# EAGLE design Main Board Schematic V5 (EAGLE 8.2.2)
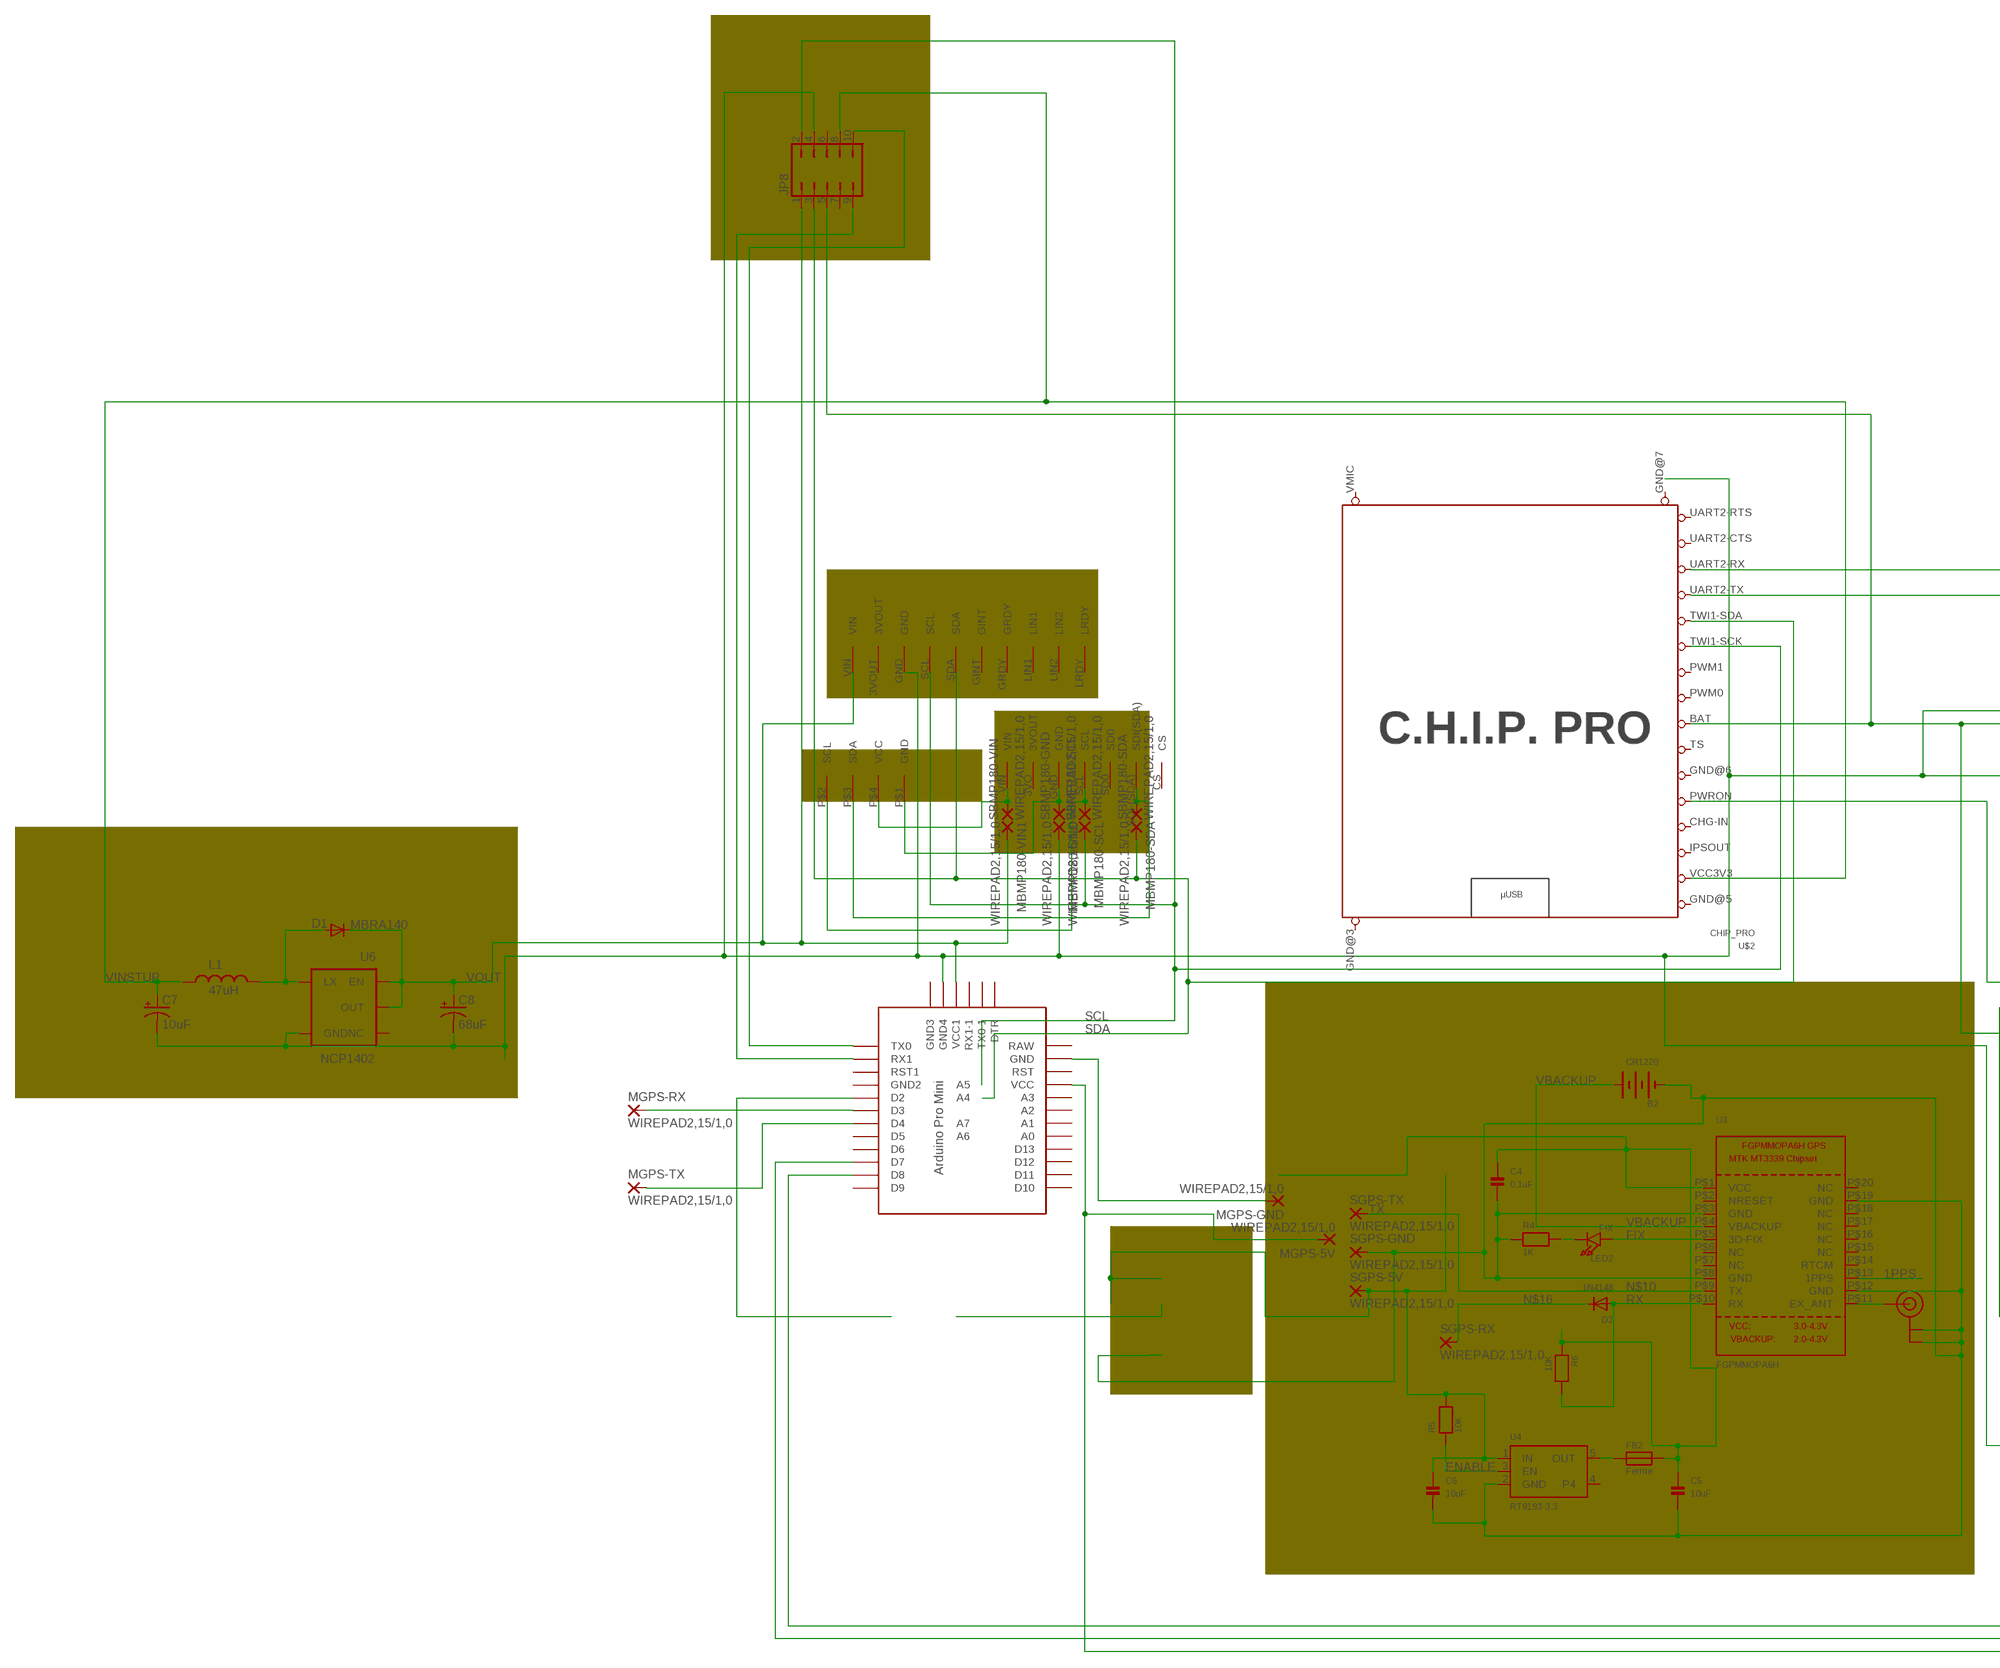
[diagram p0: schematic, sheet 1, part 1 of 2]
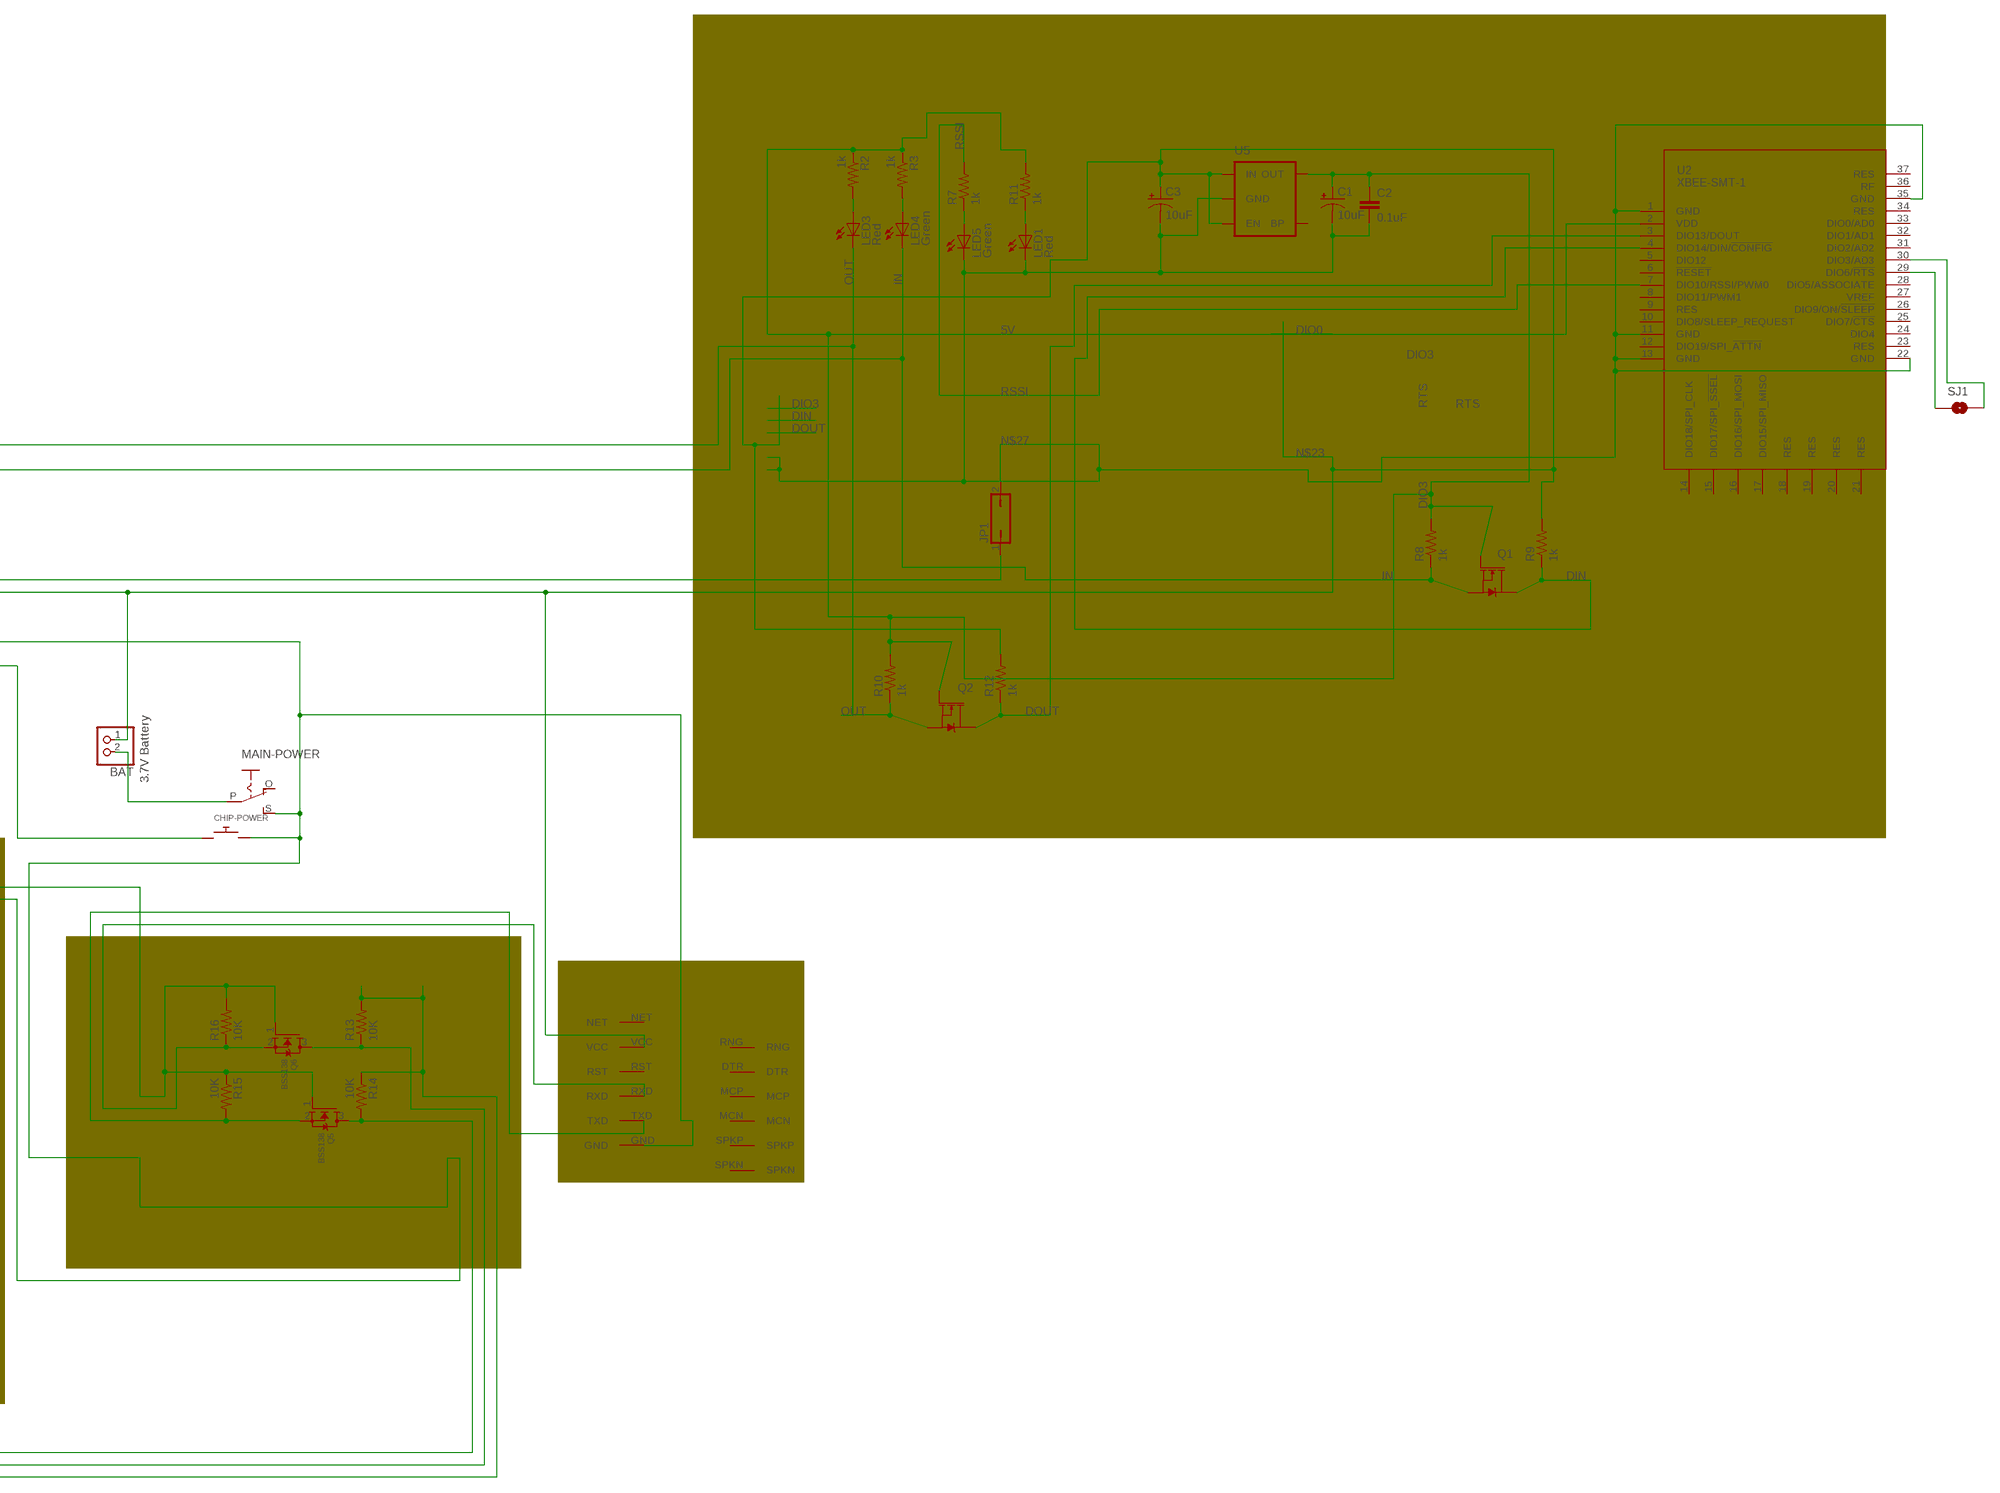
[diagram p1: schematic, sheet 1, part 2 of 2]

## Parts
B2  CR1220  BATTERYCR1220_SMT  [CR1220]
BAT  JST_2PIN-THM-RA  [JST-PH-2-THM-RA]
C1  10uF  CAP_POL1206  [EIA3216]
C2  0.1uF  CAP0402-CAP  [0402-CAP]
C3  10uF  10UF-POLAR-EIA3216-16V-10%(TANT)  [EIA3216]
C4  0.1uF  CAP_CERAMIC0805  [0805]
C5  10uF  CAP_CERAMIC0805  [0805]
C6  10uF  CAP_CERAMIC0805  [0805]
C7  10uF  CAP_POL1206  [EIA3216]
C8  68uF  68UF-POLAR-EIA3528-10V-10%(TANT)  [EIA3528]
CHIP-POWER  SWITCH_PUSHBUTTONEVQ-PE  [TACT_PANA-EVQ]
D1  MBRA140  DIODESMA  [SMA-DIODE]
D2  1N4148  DIODESOD-323F  [SOD-323F]
FB2  Ferrite  FERRITE0805  [0805]
JP1  JP1Q  [JP1]
JP8  JP5Q  [JP5Q]
L1  47uH  INDUCTORCR54  [CR54]
LED1  Red  LED0603  [LED-0603]
LED2  FIX  LED0805  [CHIPLED_0805]
LED3  Red  LED0603  [LED-0603]
LED4  Green  LED0603  [LED-0603]
LED5  Green  LED0603  [LED-0603]
MAIN-POWER  EG1218S  [EG1218]
MBMP180-GND  WIREPAD2,15/1,0  [2,15/1,0]
MBMP180-SCL  WIREPAD2,15/1,0  [2,15/1,0]
MBMP180-SDA  WIREPAD2,15/1,0  [2,15/1,0]
MBMP180-VIN1  WIREPAD2,15/1,0  [2,15/1,0]
MGPS-5V  WIREPAD2,15/1,0  [2,15/1,0]
MGPS-GND  WIREPAD2,15/1,0  [2,15/1,0]
MGPS-RX  WIREPAD2,15/1,0  [2,15/1,0]
MGPS-TX  WIREPAD2,15/1,0  [2,15/1,0]
Q1  5.8A/30V/35mΩ  MOSFET-NCH-AO3404A  [SOT23-3]
Q2  5.8A/30V/35mΩ  MOSFET-NCHANNEL-AO3404A  [SOT23-3]
Q5  BSS138  MOSFET-NREFLOW  [SOT23]
Q6  BSS138  MOSFET-NREFLOW  [SOT23]
R2  1k  RESISTOR0402-RES  [0402-RES]
R3  1k  RESISTOR0402-RES  [0402-RES]
R4  1K  RESISTOR0805  [0805]
R5  10K  RESISTOR0805  [0805]
R6  10K  RESISTOR0805  [0805]
R7  1k  RESISTOR0402-RES  [0402-RES]
R8  1k  RESISTOR0402-RES  [0402-RES]
R9  1k  RESISTOR0402-RES  [0402-RES]
R10  1k  RESISTOR0402-RES  [0402-RES]
R11  1k  RESISTOR0402-RES  [0402-RES]
R12  1k  RESISTOR0402-RES  [0402-RES]
R13  10K  R-US_R0805  [R0805]
R14  10K  R-US_R0805  [R0805]
R15  10K  R-US_R0805  [R0805]
R16  10K  R-US_R0805  [R0805]
SBMP180-GND  WIREPAD2,15/1,0  [2,15/1,0]
SBMP180-SCL  WIREPAD2,15/1,0  [2,15/1,0]
SBMP180-SDA  WIREPAD2,15/1,0  [2,15/1,0]
SBMP180-VIN  WIREPAD2,15/1,0  [2,15/1,0]
SGPS-5V  WIREPAD2,15/1,0  [2,15/1,0]
SGPS-GND  WIREPAD2,15/1,0  [2,15/1,0]
SGPS-RX  WIREPAD2,15/1,0  [2,15/1,0]
SGPS-TX  WIREPAD2,15/1,0  [2,15/1,0]
SJ1  SOLDERJUMPERNO  [SJ_2S-NO]
U2  XBEE-SMT-1  [XBEE-SMT]
U3  FGPMMOPA6H  GPS_FGPMMOPA6H  [FGPMMOPA6H]
U4  RT9193-3.3  VREG_SOT23-5  [SOT23-5]
U5  V_REG_LDOSMD  [SOT23-5@1]
U6  NCP1402  V_REG_NCP1400SOT23-5  [SOT23-5]
U$1  D6T  [D6T]
U$2  CHIP_PRO  [CHIP_PRO]
U$3  BMP180PINOUTBMP180  [BMP180]
U$4  9DOF  [9DOF]
U$5  PRO-MINI-2  [PRO-MINI-2]
U$8  SIM800L  [SIM800L]
U$32  U.FL  [U.FL]

## Nets
1PPS: U3.P$13(1PPS)
5V: C1.A(+) C2.1 Q1.1(G) Q2.1(G) R2.1 R3.1 R8.2 R10.2 R11.2 U2.2(VDD) U5.5(OUT)
A1: Q6.2(S) R16.1 U$8.RXD
A2: Q5.2(S) R15.2 U$8.TXD
B1: Q6.3(D) R13.1 U$5.D7
B2: Q5.3(D) R14.2 U$5.D8
DIN: Q1.3(D) R9.1 U2.4(DIO14/DIN/!CONFIG)
DIO3: SJ1.2 U2.30(DIO3/AD3)
DOUT: Q2.3(D) R12.1 U2.3(DIO13/DOUT)
ENABLE: R5.1 U4.3(EN)
FIX: LED2.A U3.P$5(3D-FIX)
GND: SBMP180-GND.1(P) U$1.P$1(GND) U$3.GND
IN: LED4.C Q1.2(S) R8.1 U$2.UART2-TX
N$1: LED2.C R4.2
N$2: BAT.2 MAIN-POWER.P
N$3: JP8.2 MBMP180-SCL.1(P) U$2.TWI1-SCK U$4.SCL U$5.A5
N$5: FB2.1 U4.5(OUT)
N$6: U3.P$11(EX_ANT) U$32.P$3(SIGNAL)
N$7: CHIP-POWER.P$1 U$2.PWRON
N$8: JP8.3 MBMP180-SDA.1(P) U$2.TWI1-SDA U$4.SDA U$5.A4
N$9: LED3.A R2.2
N$10: SGPS-TX.1(P) U3.P$9(TX)
N$11: LED4.A R3.2
N$12: JP8.10 U$5.TX0
N$13: LED5.A R7.1
N$14: D1.A L1.P$2 U6.5(LX)
N$15: JP8.9 U$5.RX1
N$16: D2.C SGPS-RX.1(P)
N$17: MGPS-GND.1(P) U$5.GND
N$18: U$5.D2
N$19: SBMP180-VIN.1(P) U$1.P$4(VCC) U$3.VIN
N$21: SBMP180-SCL.1(P) U$1.P$2(SCL) U$3.SCL
N$22: SBMP180-SDA.1(P) U$1.P$3(SDA) U$3.SDI-(SDA)(SDI(SDA))
N$23: BAT.1 C3.+ JP8.5 Q5.1(G) Q6.1(G) R9.2 R12.2 R15.1 R16.2 U5.1(IN) U5.3(EN) U$2.BAT U$8.VCC
N$24: C4.1 C5.1 FB2.2 R6.1 U3.P$1(VCC)
N$27: C1.C(-) C2.2 C3.- JP1.2 LED1.C LED5.C U2.1(GND) U2.11(GND) U2.13(GND) U2.22(GND) U2.35(GND) U5.2(GND)
N$29: MGPS-5V.1(P) R13.2 R14.1 U$5.VCC
N$33: C6.1 R5.2 SGPS-5V.1(P) U4.1(IN)
N$34: B2.- C4.2 C5.2 C6.2 R4.1 SGPS-GND.1(P) U3.P$3(GND) U3.P$8(GND) U3.P$12(GND) U3.P$19(GND) U4.2(GND) U$32.P$1(GND) U$32.P$2(GND)
N$35: C7.C(-) C8.C(-) CHIP-POWER.P$2 JP1.1 JP8.4 MAIN-POWER.S MBMP180-GND.1(P) U6.4(GND) U$4.GND U$5.GND3(GND4) U$8.GND
N$38: LED1.A R11.1
OUT: LED3.C Q2.2(S) R10.1 U$2.UART2-RX
RSSI: R7.2 U2.7(DIO10/RSSI/PWM0)
RTS: SJ1.1 U2.29(DIO6/!RTS)
RX: D2.A R6.2 U3.P$10(RX)
RX_5V: MGPS-RX.1(P) U$5.D3
TX: MGPS-TX.1(P) U$5.D4
VBACKUP: B2.+$1(+) U3.P$4(VBACKUP)
VINSTUP: C7.A(+) JP8.8 L1.P$1 U$2.VCC3V3
VOUT: C8.A(+) D1.C JP8.1 MBMP180-VIN1.1(P) U6.1(EN) U6.2(OUT) U$4.VIN U$5.VCC1
Unconnected: JP8.6 JP8.7 MAIN-POWER.O U2.5(DIO12) U2.6(!RESET) U2.8(DIO11/PWM1) U2.9(RES) U2.10(DIO8/SLEEP_REQUEST) U2.12(DIO19/SPI_!ATTN) U2.14(DIO18/SPI_CLK) U2.15(DIO17/SPI_!SSEL) U2.16(DIO16/SPI_MOSI) U2.17(DIO15/SPI_MISO) U2.18(RES) U2.19(RES) U2.20(RES) U2.21(RES) U2.23(RES) U2.24(DIO4) U2.25(DIO7/!CTS) U2.26(DIO9/ON/!SLEEP) U2.27(VREF) U2.28(DIO5/ASSOCIATE) U2.31(DIO2/AD2) U2.32(DIO1/AD1) U2.33(DIO0/AD0) U2.34(RES) U2.36(RF) U2.37(RES) U3.P$2(NRESET) U3.P$6(NC) U3.P$7(NC) U3.P$14(RTCM) U3.P$15(NC) U3.P$16(NC) U3.P$17(NC) U3.P$18(NC) U3.P$20(NC) U4.4 U5.4(BP) U6.3(NC) U$2.PWM0 U$2.PWM1 U$2.TS U$2.UART2-CTS U$2.UART2-RTS U$2.VMIC U$3.3VO(3VOUT) U$3.CS U$3.SD0 U$4.3VOUT U$4.GINT U$4.GRDY U$4.LIN1 U$4.LIN2 U$4.LRDY U$5.A0 U$5.A1 U$5.A2 U$5.A3 U$5.A6 U$5.A7 U$5.D5 U$5.D6 U$5.D9 U$5.D10 U$5.D11 U$5.D12 U$5.D13 U$5.DTR U$5.GND1(GND2) U$5.GND2(GND3) U$5.RAW U$5.RST U$5.RST1 U$5.RX1-1 U$5.TX0-1 U$8.DTR U$8.MCN U$8.MCP U$8.NET U$8.RNG U$8.RST U$8.SPKN U$8.SPKP

## Notes on the sheet
- HEADERS
- MIC5219-3.3V
- 500mA peak
- 9DOF IMU
- D6T Pins
  GND VCC SDA SCL
- BMP180
- 5V step up | 3.7V Battery
- XBee 3.3V Step Down
- SCL
- SDA | GPS
- SIM800L
- DHT22
- Logic Level Shifter 2Chnl
- gnd to gnd
- D1+R3 restrict RX input to 3.3V

## Power pins joined to a net without a drawn wire
CHG-IN: U$2.CHG-IN
GND: U$2.GND@3(GND) U$2.GND@5(GND) U$2.GND@6(GND) U$2.GND@7(GND)
IPSOUT: U$2.IPSOUT

## Library data of the parts
B2 = microbuilder:BATTERY
BAT = adafruit:JST_2PIN: JST 2-Pin Connectors of various flavors SMT-RA (S2B-PH-SM4) 4UConnector #17311 SMT (B2B-PH-SM4) THM-RA (S2B-PH) THM (B2B-PH)
C1 C7 = SparkFun:CAP_POL: Capacitor Polarized These are standard SMD and PTH capacitors. Normally 10uF, 47uF, and 100uF in electrolytic and tantalum varieties. Always verify the external diameter of the through hole cap, it varies with capacity, voltage, and manufacturer. The EIA devices should be standard.
C2 = SparkFun:CAP: Capacitor Standard 0603 ceramic capacitor, and 0.1" leaded capacitor.
C3 = SparkFun-Capacitors:10UF-POLAR: 10.0µF polarized capacitors A capacitor is a passive two-terminal electrical component used to store electrical energy temporarily in an electric field.; PROD_ID: CAP-00811
C4-C6 = microbuilder:CAP_CERAMIC: Ceramic Capacitors 0402 - 0402 Surface Mount Capacitors 16pF 50V 5% [Digikey: 445-4899-2-ND] 18pF 50V 5% [Digikey: 490-1281-2-ND] 22pF 50V 5% [Digikey: 490-1283-2-ND] 68pF 50V 5% [Digikey: 490-1289-2-ND] 0.1uF 10V 10% [Digikey: 490-1318-2-ND] 1.0uF 6.3V 10% [Digikey: 490-1320-2-ND] 0603 - 0603 Surface Mount Capacitors 16 pF 50V 5% [Digikey: 445-5051-2-ND] 22 pF 50V [Digikey: PCC220ACVTR-ND] 33 pF 50V 5% [Digikey: 490-1415-1-ND] 56pF 50V 5% [Digikey: 490-1421-1-ND] 220pF 50V 5% [Digikey: 445-1285-1-ND] 680 pF 50V 2200 pF 50V 5% C0G [Digikey: 445-1297-1-ND] 5600 pF 100V 5% X7R [Digikey: 478-3711-1-ND] 0.1 µF 25V 10% [Digikey: PCC2277TR-ND] 0.22 µF 16V 10% X7R [Digikey: 445-1318-1-ND] 1.0 µF 25V 10% [Digikey: 445-5146-2-ND] 0603 - RF Specific 3pF 250V +/-0.1pF RF [Digikey: 712-1347-1-ND] 18 pF 250V 5% [Digikey: 478-3505-1-ND or 712-1322-1-ND] 56 pF 250V 5% C0G RF [Digikey: 490-4867-1-ND] 68 pF 250V RF [Digikey: 490-4868-1-ND] 0805 - 0805 Surface Mount Capacitors 220 pF 250V 2% RF Ceramic Capacitor [Digikey: 712-1398-1-ND] 1000 pF 50V 2% NP0 Ceramic Capacitor [Digikey: 478-3760-1-ND] 0.1 µF 25V 10% Ceramic Capacitor [Digikey: PCC1828TR-ND] 1.0 µF 16V 10% Ceramic Capacitor[Digikey: 490-1691-2-ND] 10.0 µF 10V 10% Ceramic Capacitor[Digikey: 709-1228-1-ND] 10.0 uF 16V 10% Ceramic Capacitor [Digikey: 478-5165-2-ND] 47 uF 6.3V 20% Ceramic Capacitor [Digikey: 587-1779-1-ND or 399-5506-1-ND] 1206 - 1206 Surface Mount Capacitors 47uF 10V 20% Ceramic Capacitor [Digikey: 490-5528-1-ND or 399-5508-1-ND or 445-6010-1-ND] 100uF 6.3V -20%, +80% Y5V Ceramic Capacitor (Digikey: 490-4512-1-ND, Mouser: 81-GRM31CF50J107ZE1L)
C8 = SparkFun-Capacitors:68UF-POLAR: 68µF polarized capacitors A capacitor is a passive two-terminal electrical component used to store electrical energy temporarily in an electric field.; PROD_ID: CAP-10790
CHIP-POWER = adafruit:SWITCH_PUSHBUTTON: Buttons SOFTTOUCHSMD_SJ - Soft touch temporary push button (Super Junk Akihabara) Compatible with SKPMANE010 [Mouser: 688-SKPMAN] C&K_KSS = Digikey: KSS221GLFS
D1 = SparkFun:DIODE: Diode
D2 = adafruit:DIODE: Diode
FB2 = microbuilder:FERRITE: Ferrite Bead 0603 MMZ1608B121C - 120 Ohm, 600mA Ferrite Chip - Digikey: 445-2164-1-ND BK1608HW121-T - 120 Ohm, 600mA Ferrite Chip - Digikey: 587-1876-2-ND
JP1 = jumper:JP1Q: JUMPER
JP8 = jumper:JP5Q: JUMPER
L1 = SparkFun:INDUCTOR: Inductors Basic Inductor/Choke - 0603 and 1206. Footprints are not proven and vary greatly between part numbers.
LED1 LED3-LED5 = SparkFun:LED: LEDs Standard schematic elements and footprints for 5mm, 3mm, 1206, and 0603 sized LEDs. 5mm - Spark Fun Electronics SKU : COM-00529 (and others)
LED2 = microbuilder:LED: LED 0603 - 0603 Surface Mount Package 2mA: Green LED - Low Power (3.9mcd, 2ma, 1.7Vf) - Digikey: 475-2709-2-ND Orange LED - Low Power (9.8mcd, 2ma, 1.8Vf) - Digikey: 475-1194-2-ND Red LED - Low Power (5mcd, 2ma, 1.8Vf) - Digikey: 475-1195-2-ND Yellow LED - Low Power (7mcd, 2ma, 1.8Vf) - Digikey: 475-1196-2-ND 5mA: Blue LED - Low Power (17mcd, 5ma, 2.9Vf) - Digikey: LNJ937W8CRACT-ND 0805 - 0805 Surface Mount Package 2mA: Red LED (8.8mcd, 2mA, 1.8Vf, Clear) - Low Power [Digikey: 475-2510-1-ND] Green LED (5mcd, 2mA, 1.8Vf, Clear) - Low Power [Digikey: 475-2730-1-ND] Yellow LED (11.3mcd, 2mA, 1.8Vf, Clear) - Low Power [Digikey: 475-2555-1-ND] 20mA: Red LED (104mcd, 20mA, Diffused) - LS R976 [Digikey: 475-1278-6-ND] Red LED (12mcd, 20mA, 2.0Vf, Clear) - APT2012EC [Digikey: 754-1128-1-ND] Green LED (15mcd, 20mA, 2.2Vf, Clear) - APT2012GC [Digikey: 754-1131-1-ND] Orange LED (160mcd, 20mA, 2.1Vf, Clear) - APT2012SECK [Digikey: 754-1130-1-ND] 1206 - 1206 Surface Mount Package Green LED (26mcd, 20mA, Diffused) - LG N971 [Digikey: 475-1407-6-ND] Red LED (15mcd, 20mA, Diffused) - LH N974 [Digikey: 475-1416-6-ND]
MAIN-POWER = adafruit:EG1218: SLIDING SWITCH 0.1" spacing through hole, vertical SPDT slide switch http://www.ladyada.net/library/pcb/eaglelibrary.html
MBMP180-GND MBMP180-SCL MBMP180-SDA MBMP180-VIN1 MGPS-5V MGPS-GND MGPS-RX MGPS-TX SBMP180-GND SBMP180-SCL SBMP180-SDA SBMP180-VIN SGPS-5V SGPS-GND SGPS-RX SGPS-TX = wirepad:WIREPAD: Wire PAD connect wire on PCB
Q1 = SparkFun-DiscreteSemi:MOSFET-NCH: N-channel MOSFETs Voltage controlled devices that allow control of high current outputs. SparkFun Products: SparkFun OpenScale <https://www.sparkfun.com/products/13261> SparkFun Digital Sandbox <https://www.sparkfun.com/products/12651> SparkFun Monster Moto Shield <https://www.sparkfun.com/products/10182> SparkFun MOSFET Power Controller <https://www.sparkfun.com/products/11214>; PROD_ID: TRANS-12988
Q2 = SparkFun-DiscreteSemi:MOSFET-NCHANNEL: N-channel MOSFETs Voltage controlled devices that allow control of high current outputs. SparkFun Products: SparkFun OpenScale <https://www.sparkfun.com/products/13261> SparkFun Digital Sandbox <https://www.sparkfun.com/products/12651> SparkFun Monster Moto Shield <https://www.sparkfun.com/products/10182> SparkFun MOSFET Power Controller <https://www.sparkfun.com/products/11214>; PROD_ID: TRANS-12988
Q5 Q6 = adafruit:MOSFET-N: N-Channel Mosfet 2N7002E - 60V 260mA SOT23 [Digikey: 2N7002ET1GOSTR-ND] - REEL BSH103 - 30V 850mA SOT23 [Digikey: 568-5013-1-ND]
R2 R3 R7-R12 = SparkFun:RESISTOR: Resistor Basic schematic elements and footprints for 0603, 1206, and PTH 1/10th watt (small) resistors.
R4-R6 = microbuilder:RESISTOR: Resistors 0402 - 0402 Surface Mount Package 22 Ohm 1% 1/16W [Digikey: 311-22.0LRTR-ND] 33 Ohm 5% 1/16W 1.0K 5% 1/16W 1.5K 5% 1/16W 2.0K 1% 1/16W 10.0K 1% 1/16W [Digikey: 311-10.0KLRTR-ND] 10.0K 5% 1/16W [Digikey: RMCF0402JT10K0TR-ND] 12.1K 1% 1/16W [Digikey: 311-22.0LRTR-ND] 100.0K 5% 1/16W 0603 - 0603 Surface Mount Package 0 Ohm 1/10 Watt 1% Resistor 15 Ohm 1/10 Watt 1% Resistor 33 Ohm 1/10 Watt 1% Resistor 49.9 Ohm 1/10 Watt 1% Resistor 100 Ohm 1/10 Watt 1% Resistor 150 Ohm 1/10 Watt 1% Resistor 240 Ohm 1/10 Watt 1% Resistor 390 Ohm 1/10 Watt 1% Resistor 560 Ohm 1/10 Watt 1% Resistor 680 Ohm 1/10 Watt 1% Resistor 750 Ohm 1/10 Watt 1% Resistor 1.0K Ohm 1/10 Watt 1% Resistor 1.5K Ohm 1/10 Watt 1% Resistor 2.0K Ohm 1/10 Watt 1% Resistor 2.2K Ohm 1/10 Watt 1% Resistor 3.3K Ohm 1/10 Watt 1% Resistor 4.7K Ohm 1/10 Watt 1% Resistor 10.0K Ohm 1/10 Watt 1% Resistor 12.0K Ohm 1/10 Watt 1% Resistor 12.1K Ohm 1/10 Watt 1% Resistor 20.0K Ohm 1/10 Watt 1% Resistor 33.0K Ohm 1/10 Watt 1% Resistor 100.0K Ohm 1/10 Watt 1% Resistor 0805 - 0805 Surface Mount Package 0 Ohm 1/8 Watt 1% Resistor 33 Ohm 1/8 Watt 1% Resistor 100 Ohm 1/8 Watt 1% Resistor 150 Ohm 1/8 Watt 1% Resistor 200 Ohm 1/8 Watt 1% Resistor 240 Ohm 1/8 Watt 1% Resistor 330 Ohm 1/8 Watt 1% Resistor 390 Ohm 1/8 Watt 1% Resistor 470 Ohm 1/8 Watt 1% Resistor 1.0K Ohm 1/8 Watt 1% Resistor 1.5K Ohm 1/8 Watt 1% Resistor 2.0K Ohm 1/8 Watt 1% Resistor 4.7K Ohm 1/8 Watt 1% Resistor 5.1K Ohm 1/8 Watt 1% Resistor 5.6K Ohm 1/8 Watt 1% Resistor 10.0K Ohm 1/8 Watt 1% Resistor 22.0K Ohm 1/8 Watt 1% Resistor 33.0K Ohm 1/8 Watt 1% Resistor 100K Ohm 1/8 Watt 1% Resistor 1206 - 1206 Surface Mount Package 2012 - 2010 Surface Mount Package 0.11 Ohm 1/2 Watt 1% Resistor - Digikey: RHM.11UCT-ND
R13-R16 = adafruit:R-US_: RESISTOR, American symbol
SJ1 = SparkFun:SOLDERJUMPER: Solder Jumper Standard SMD solder jumper. Used to automate production. Two varients : Normally Open and Normally Closed are the same, but have different paste layers. NC will have a large amount of paste and should jumper during reflow.
U2 = rlc:XBEE-SMT-1
U3 = microbuilder:GPS_FGPMMOPA6H: GPS Module - MTK MT3339 Chipset, -165dBm sensitivity, 22 channels, 10Hz, auto-select external antenna options
U4 = microbuilder:VREG_SOT23-5: SOT23-5 Fixed Voltage Regulators To better organise some of the SOT23-5 fixed voltage regulators in this library, this new part was created. Part Current Out V Out V In V Dropout Digikey Part No. ADP121 150mA 3.3V 3.4-5.5V 0.09V @ 150mA ADP121-AUJZ33R7CT-ND ADP121 150mA 3.0V 3.1-5.5V 0.09V @ 150mA ADP121-AUJZ30R7CT-ND ADP122 300mA 3.3V 3.4-5.5V 0.085V @ 300mA ADP122AUJZ-3.3-R7CT-ND ADP1712 300mA 3.3V 3.5-5.5V 0.17V @ 300mA ADP1712AUJZ-3.3-R7TR-ND AP7311 (Low Cost) 150mA 3.3V 3.5-6V 0.15V @ 150mA AP7311-33WG-7DICT-ND LD39015M18R 150mA 1.8V 1.9V-5.5V 0.08V @ 100mA 497-6977-1-ND MCP1824T-3302E/OT 300mA 3.3V 3.5V-6V 0.2V @ 300mA MCP1824T-3302E/OTCT-ND MIC5205-2.5YM5 TR 150mA 2.5V 2.7-16V 0.165V @ 150mA 576-1257-2-ND MIC5205-3.0YM5 TR 150mA 3.0V 3.2V-16V 0.165V @ 150mA 576-1258-2-ND MIC5205-3.3YM5 TR 150mA 3.3V 3.5V-16V 0.165V @ 150mA 576-1259-2-ND TPS780330220 150mA 3.3V+2.2V 3.6-5.5V 250mV Max 296-23332-1-ND TDA3663/N1,135 100mA 3.3V 3.5-45V 0.18V @ 50mA 568-5343-1-ND
U5 = SparkFun:V_REG_LDO: Voltage Regulator LDO Standard 150mA LDO voltage regulator in SOT-23 layout. Micrel part MIC5205. BP (by-pass) pin is used to lower output noise with 470pF cap.
U6 = SparkFun:V_REG_NCP1400: Switching step-up voltage regulator NCP1400 switiching regulator takes single cell AA and outputs 100mA at 3.3V or 5V with minimal number of external components.
U$1 = D6T Pins:D6T
U$2 = CHIP_Pro-Footprint:CHIP_PRO
U$3 = BME180:BMP180PINOUT
U$4 = 9DOF IMU:9DOF
U$5 = Arduino-clone:PRO-MINI-2: Arduino Pro Mini Layout 2 Sparkfun.com
U$8 = SIM800L:SIM800L
U$32 = microbuilder:U.FL: U.FL Antenna Connector

## Net classes
1 vcc: width 0.305 mm

## Board
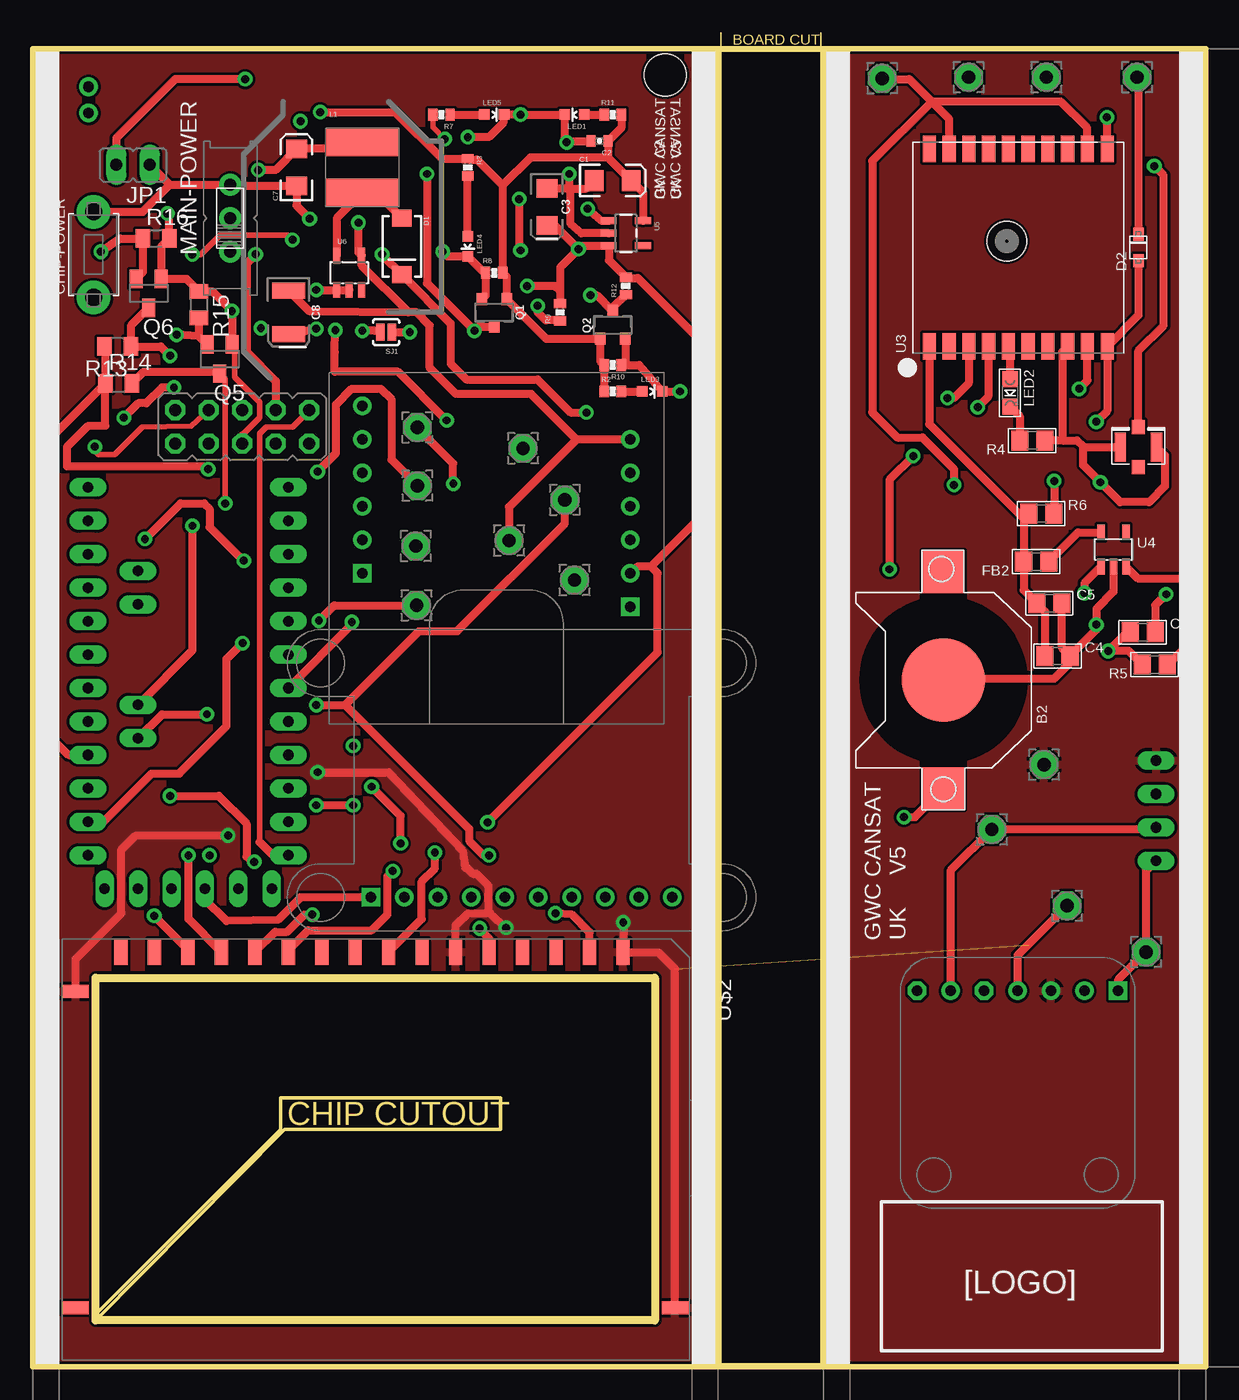
[diagram p2: board, top side]
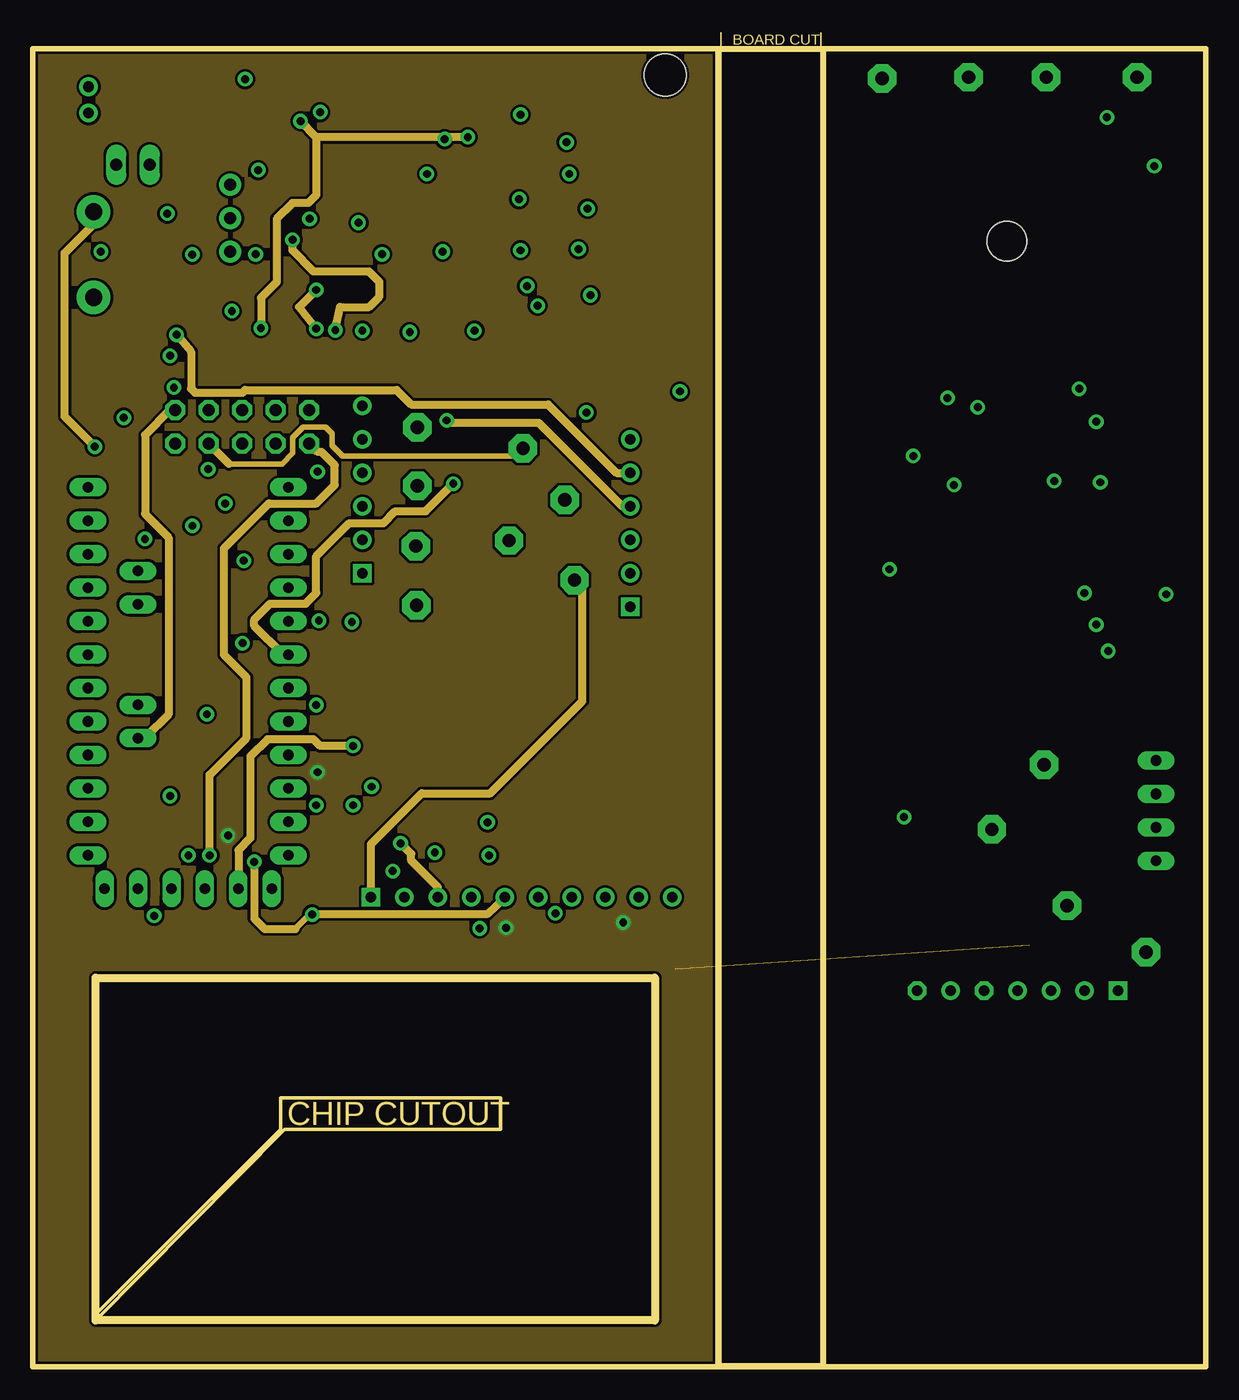
[diagram p3: board, inner layer Route2]
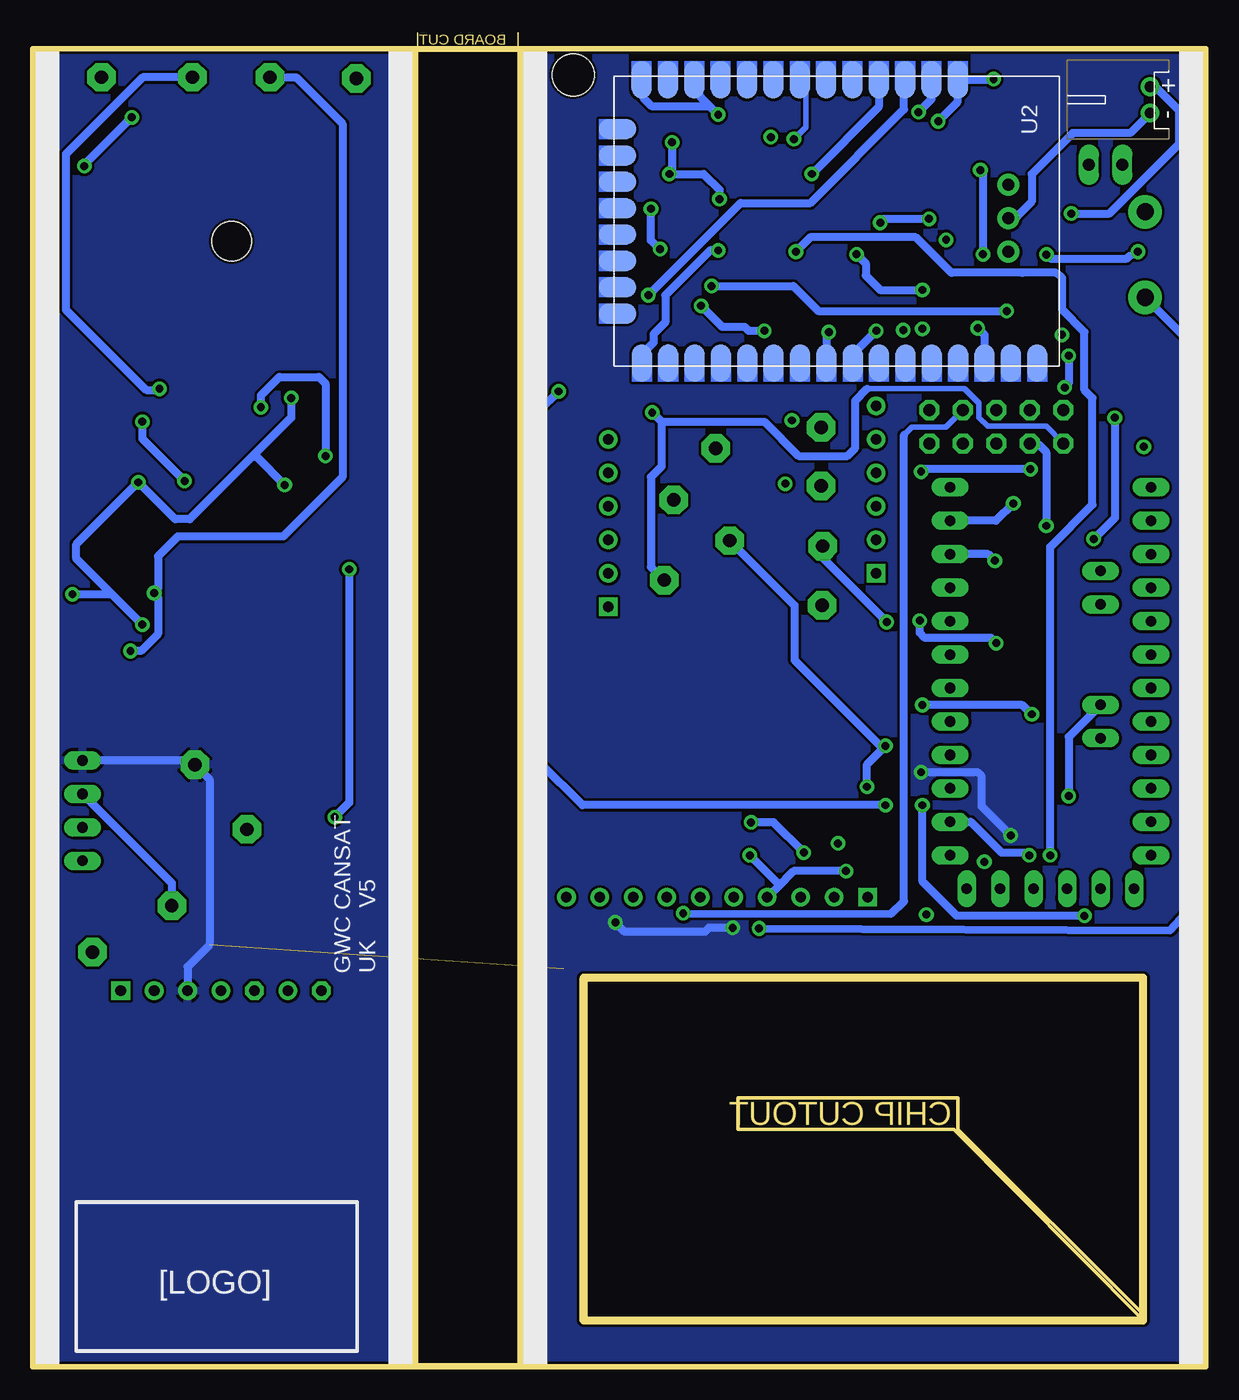
[diagram p4: board, bottom side, seen from below]

Size 89 x 101.2 mm. Coordinates in mm from the lower left corner, seen from the top.
Outline: 52,0 0,0 0,100 52,100
Outline: 52,0 52,100
Outline: 60,0 60,100
Outline: 60,100 89,100 89,0 60,0
Outline: 52,0 60,0
Outline: 52,100 60,100
Outline: 52.2,99.8 52.2,101.2
Outline: 59.8,100.2 59.8,101.2
Outline: 4.75,29.5 47.2,29.5 47.2,3.5 4.75,3.5 4.75,29.5
Copper layers (1*16): Top 0.035mm / dielectric 1.5mm / Bottom 0.035mm
Design rules "SparkFun": minimum track width 8mil, minimum drill 20mil, track to track 8mil, track to pad 8mil, pad to pad 8mil, via to via 8mil, smd to smd 8mil, copper to edge 8mil, drill to drill 8mil, minimum pad ring 12mil, minimum via ring 10mil, stop-mask expansion 4mil, vias tented up to drill 20mil, thermal gap 10mil
Holes 3.2 mm at 48,98

### Footprints (pad centres in the part's own frame; a part is rotated, then mirrored left to right if it is on the bottom)
CR1220 = smd 3.2 x 3.2: +$1 -8.225,0; +$2 8.225,0 | smd 6.35 x 6.35: - 0,0
JST-PH-2-THM-RA = drill 0.8 pad 1.422: 1 1,0; 2 -1,0
EIA3216 = smd 1.4 x 1.6: A 1.4,0; C -1.4,0
0402-CAP = smd 0.7 x 0.9: 1 -0.65,0; 2 0.65,0
EIA3216' = smd 1.4 x 1.6: + 1.4,0; - -1.4,0
0805 = smd 1.3 x 1.5: 1 -0.95,0; 2 0.95,0
EIA3528 = smd 1.2 x 2.5: A 1.65,0; C -1.65,0
TACT_PANA-EVQ = drill 1.3 pad 2.54: P$1 -3.25,0; P$2 3.25,0
SMA-DIODE = smd 1.27 x 1.47: A -2.15,0; C 2.15,0
SOD-323F = smd 1 x 0.8: A -1,0; C 1,0
JP1 = drill 0.914 long: 1 0,-1.27; 2 0,1.27
JP5Q = drill 0.914 octagon: 1 -5.08,-1.27; 2 -5.08,1.27; 3 -2.54,-1.27; 4 -2.54,1.27; 5 0,-1.27; 6 0,1.27; 7 2.54,-1.27; 8 2.54,1.27; 9 5.08,-1.27; 10 5.08,1.27
CR54 = smd 5.5 x 2.15: P$1 0,1.92; P$2 0,-1.92
LED-0603 = smd 0.8 x 0.8: A 0,-0.75; C 0,0.75
CHIPLED_0805 = smd 1.2 x 1.2: A 0,-1.05; C 0,1.05
EG1218 = drill 0.9 pad 1.676: O -2.54,0; P 0,0; S 2.54,0
2,15/1,0 = drill 1.016 pad 2.159 octagon: 1 0,0
SOT23-3 = smd 0.8 x 0.9: 1 -0.95,-1; 2 0.95,-1; 3 0,1.1
SOT23 = smd 1 x 1.4: 1 -0.95,-1.1; 2 0.95,-1.1; 3 0,1.1
0402-RES = smd 0.7 x 0.9: 1 -0.65,0; 2 0.65,0
R0805 = smd 1.1 x 1.4: 1 -1,0; 2 1,0
SJ_2S-NO = smd 0.635 x 1.27: 1 -0.45,0; 2 0.45,0
XBEE-SMT = smd 2.84 x 1.52: 1 -10.745,9.19; 2 -10.745,7.19; 3 -10.745,5.19; 4 -10.745,3.19; 5 -10.745,1.19; 6 -10.745,-0.81; 7 -10.745,-2.81; 8 -10.745,-4.81; 9 -10.745,-6.81; 10 -10.745,-8.81; 11 -10.745,-10.81; 12 -10.745,-12.81; 13 -10.745,-14.81; 22 10.745,-14.79; 23 10.745,-12.79; 24 10.745,-10.79; 25 10.745,-8.79; 26 10.745,-6.79; 27 10.745,-4.79; 28 10.745,-2.79; 29 10.745,-0.79; 30 10.745,1.21; 31 10.745,3.21; 32 10.745,5.21; 33 10.745,7.21; 34 10.745,9.21; 35 10.745,11.21; 36 10.745,13.21; 37 10.745,15.21 | smd 1.52 x 2.84: 14 -7,-16.64; 15 -5,-16.64; 16 -3,-16.64; 17 -1,-16.64; 18 1,-16.64; 19 3,-16.64; 20 5,-16.64; 21 7,-16.64
FGPMMOPA6H = smd 2 x 1: P$1 -7.5,6.75; P$2 -7.5,5.25; P$3 -7.5,3.75; P$4 -7.5,2.25; P$5 -7.5,0.75; P$6 -7.5,-0.75; P$7 -7.5,-2.25; P$8 -7.5,-3.75; P$9 -7.5,-5.25; P$10 -7.5,-6.75; P$11 7.5,-6.75; P$12 7.5,-5.25; P$13 7.5,-3.75; P$14 7.5,-2.25; P$15 7.5,-0.75; P$16 7.5,0.75; P$17 7.5,2.25; P$18 7.5,3.75; P$19 7.5,5.25; P$20 7.5,6.75 | hole 3: 0.5,0.85
SOT23-5 = smd 0.55 x 1.2: 1 -0.95,-1.3; 2 0,-1.3; 3 0.95,-1.3; 4 0.95,1.3; 5 -0.95,1.3
SOT23-5@1 = smd 0.55 x 1.2: 1 -0.95,-1.3; 2 0,-1.3; 3 0.95,-1.3; 4 0.95,1.3; 5 -0.95,1.3
D6T = drill 0.8 long: P$1 0,0; P$2 0,2.54; P$3 0,5.08; P$4 0,7.62
CHIP_PRO = smd 2 x 1: BAT -15,1.27; CHG-IN -15,11.43; GND@5 -15,19.05; GND@6 -15,6.35; IPSOUT -15,13.97; PWM0 -15,-1.27; PWM1 -15,-3.81; PWRON -15,8.89; TS -15,3.81; TWI1-SCK -15,-6.35; TWI1-SDA -15,-8.89; UART2-CTS -15,-16.51; UART2-RTS -15,-19.05; UART2-RX -15,-13.97; UART2-TX -15,-11.43; VCC3V3 -15,16.51 | smd 1 x 2: GND@3 12,23; GND@7 -12,-22.5; VMIC 12,-22.5
BMP180 = drill 0.8: 3VO 2.54,0; GND 5.08,0; SCL 7.62,0; SDI-(SDA) 12.7,0 | drill 0.8 octagon: CS 15.24,0; SD0 10.16,0 | drill 0.8 square: VIN 0,0
9DOF = drill 0.8: 3VOUT 2.54,0; GINT 12.7,0; GND 5.08,0; GRDY 15.24,0; LIN1 17.78,0; LIN2 20.32,0; LRDY 22.86,0; SCL 7.62,0; SDA 10.16,0 | drill 0.8 square: VIN 0,0
PRO-MINI-2 = drill 0.8 long: A0 6.35,2.54; A1 6.35,0; A2 6.35,-2.54; A3 6.35,-5.08; A4 2.54,1.27; A5 2.54,3.81; A6 2.54,-8.89; A7 2.54,-6.35; D2 -8.89,2.54; D3 -8.89,0; D4 -8.89,-2.54; D5 -8.89,-5.08; D6 -8.89,-7.62; D7 -8.89,-10.16; D8 -8.89,-12.7; D9 -8.89,-15.24; D10 6.35,-15.24; D11 6.35,-12.7; D12 6.35,-10.16; D13 6.35,-7.62; DTR 5.08,15.24; GND 6.35,10.16; GND1 -8.89,5.08; GND2 -7.62,15.24; GND3 -5.08,15.24; RAW 6.35,12.7; RST 6.35,7.62; RST1 -8.89,7.62; RX1 -8.89,10.16; RX1-1 0,15.24; TX0 -8.89,12.7; TX0-1 2.54,15.24; VCC 6.35,5.08; VCC1 -2.54,15.24
SIM800L = drill 0.8: DTR 0,7.62; GND -20.32,0; MCN 0,2.54; MCP 0,5.08; RST -20.32,7.62; RXD -20.32,5.08; SPKN 0,-2.54; SPKP 0,0; TXD -20.32,2.54; VCC -20.32,10.16 | drill 0.8 square: NET -20.32,12.7; RNG 0,10.16
U.FL = smd 2.2 x 0.85: P$1 0,1.375; P$2 0,-1.375 | smd 1.05 x 1: P$3 1.525,0; P$4 -1.525,0

### Placement (x,y rotation side)
B2  69.1,52.09 90 top
BAT  4.22,96.12 90 bottom
C1  44,90 0 top
C2  43,93 180 top
C3  10uF  [EIA3216']  39,88 270 top
C4  77.75,53.92 0 top
C5  77.13,57.92 0 top
C6  84.22,55.73 0 top
C7  20,91 90 top
C8  19.4,80 270 top
CHIP-POWER  4.6,84.38 90 top
D1  28,85 270 top
D2  83.89,84.93 90 top
FB2  76.13,61.08 180 top
JP1  7.6,91.2 90 top
JP8  15.88,71.32 0 top
L1  25,91 0 top
LED1  41.1,95 90 top
LED2  74.15,73.89 180 top
LED3  47,74 270 top
LED4  33,85 180 top
LED5  35,95 270 top
MAIN-POWER  14.97,87.14 90 top
MBMP180-GND  36.13,62.68 0 top
MBMP180-SCL  40.37,65.76 0 top
MBMP180-SDA  37.19,69.68 0 top
MBMP180-VIN1  41.1,59.68 0 top
MGPS-5V  29.18,66.84 0 top
MGPS-GND  29.11,57.76 0 top
MGPS-RX  29.06,62.26 0 top
MGPS-TX  29.17,71.26 0 top
Q1  35,80 180 top
Q2  44,79 0 top
Q5  14.17,76.45 180 top
Q6  8.79,81.45 180 top
R2  44,74 0 top
R3  33,91 270 top
R4  75.83,70.27 180 top
R5  85.13,53.27 180 top
R6  76.52,64.73 0 top
R7  31,95 180 top
R8  35,83 0 top
R9  40,80 90 top
R10  44,76 180 top
R11  44,95 0 top
R12  45,82 90 top
R13  6.42,77.4 180 top
R14  6.5,74.6 0 top
R15  12.6,80.58 270 top
R16  9.34,85.6 0 top
SBMP180-GND  76.72,45.68 0 top
SBMP180-SCL  78.47,34.96 0 top
SBMP180-SDA  72.77,40.76 0 top
SBMP180-VIN  84.47,31.46 0 top
SGPS-5V  71.01,97.84 0 top
SGPS-GND  64.45,97.76 0 top
SGPS-RX  83.79,97.84 0 top
SGPS-TX  76.9,97.84 0 top
SJ1  26.8,78.5 180 top
U2  28,86.9 270 bottom
U3  74.77,84.91 90 top
U4  82,62 0 top
U5  45,86 270 top
U6  24,83 0 top
U$1  85.23,45.99 180 top
U$2  25.73,16.46 270 top
U$3  82.34,28.52 180 top
U$4  25.65,35.61 0 top
U$5  10.51,51.49 180 top
U$8  25.01,70.35 180 top
U$32  83.89,69.77 90 top

### Tracks (layer width: path | path; a pad name or v marks a point on that pad's centre or on a via)
5V  (via drill 0.6)
  Top 0.61: 35.65,89.65 33.7,91.6 33.05,91.6 R3.1 31.05,91.65 27.5,95.2 v21.8,95.2 | 35.65,89.65 R8.2 35.95,82.7 Q1.1 38.95,78 Q2.1 43.05,76.3 R10.2 R2.1 | R11.2 44.65,94 C2.1 43.65,91.75 | 43.65,91.75 C1.A 46.3,89.1 U5.5 | 43.65,91.75 37.75,91.75 35.65,89.65
  Bottom 0.61: U2.2 20.81,96.19 v21.8,95.2
A1  (via drill 0.6)
  Top 0.406: v19.7,85.5 19.33,85.87 14.2,85.87 12.72,84.39 v12.09,84.39
  Top 0.61: Q6.2 8.34,83.05 R16.1 6.6,85.6 v5.15,84.6 | v31.4,71.8 27.7,75.5 22.9,75.5 22.9,76.95 v22.95,78.65
  Route2 0.61: U$8.RXD 44.73,65.27 38.4,71.6 31.6,71.6 v31.4,71.8 | v19.7,85.5 19.7,84.7 21.3,83.1 25.5,83.1 26.3,82.3 26.3,81.2 25.5,80.4 23.3,80.4 v22.95,78.65
  Bottom 0.61: v12.09,84.39 11.78,84.08 5.99,84.08 5.8,84.27 v5.15,84.6
A2  (via drill 0.6)
  Top 0.61: Q5.2 12.6,78.17 | 12.6,78.17 R15.2 | 12.6,78.17 12.57,78.2 v10.9,78.3
  Route2 0.61: v10.9,78.3 12,77 12,74.2 12.3,73.9 15.9,73.9 16.1,74.1 27.6,74.1 28.7,73 39.1,73 44.29,67.81 U$8.TXD
B1  (via drill 0.6)
  Top 0.61: Q6.3 7.42,78.98 R13.1 9.7,77.4 v10.4,76.7 | v10.7,74.3 9.8,74.3 8.6,73.1 8,73.1 v6.9,72 | v8.5,62.8 11.2,65.5 13,65.5 13.4,65.1 13.4,63.7 15.95,61.15 v16,61.15
  Bottom 0.61: v10.4,76.7 10.4,74.6 v10.7,74.3 | v6.9,72 6.9,64.4 v8.5,62.8 | v16,61.15 16.5,61.65 U$5.D7
B2  (via drill 0.6)
  Top 0.406: Q5.3 14.6,74.92 v14.6,65.5
  Top 0.61: Q5.3 14.02,75.5 8.4,75.5 R14.2
  Bottom 0.61: v14.6,65.5 15.91,64.19 U$5.D8
DIN  (via drill 0.6)
  Top 0.61: R9.1 39.95,79.4 38.9,79.4 38.3,80 v38.3,80.5 | Q1.3 33.8,78.9 v33.5,78.6 29.9,82.2 v29.9,90.5
  Bottom 0.61: v38.3,80.5 36.7,78.9 Q1.3 34.7,78.6 v33.5,78.6 | U2.4 24.81,95.59 v29.9,90.5
DIO3  (via drill 0.6)
  Top 0.61: SJ1.2 25.95,78.6 v25,78.6
  Bottom 0.61: v25,78.6 26.79,76.81 U2.30
DOUT  (via drill 0.6)
  Top 0.61: R12.1 44,80.35 Q2.3 42.8,81.3 v42.3,81.3
  Bottom 0.61: v42.3,81.3 35.3,88.3 30,88.3 22.9,95.4 22.9,97.56 U2.3
ENABLE
  Top 0.61: U4.3 83.85,59.8 87.1,59.8 87.6,59.3 87.6,54.7 86.17,53.27 R5.1
FIX
  Top 0.61: U3.P$5 74.15,77.28 LED2.A
GND  (via drill 0.6)  (1 unrouted)
  Top 0.61: U$2.GND@3 48.73,30.17 47.5,31.4 44.84,31.4 U$2.GND@5 44.8,31.48 v44.8,33.7 | U$2.GND@6 32.08,33.48 33,34.35 34.7,34.4 | 34.7,34.4 v35.9,33.3 | U$2.GND@7 3.23,30.93 6.7,34.4 6.7,39.2 7.8,40.3 v14.8,40.3 | v21.6,45.1 27,45.1 32.6,39.15 32.8,37.85 32.95,37.85 33.4,37.4 33.65,37.4 34.55,36.5 34.55,34.6 34.7,34.4
  Bottom 0.61: v35.9,33.3 37.7,33.3 38,33 44.1,33 v44.8,33.7 | v14.8,40.3 17,42.5 17,44.8 17.3,45.1 v21.6,45.1 | 76.66,45.62 SBMP180-GND.1 | SBMP180-GND.1 77.03,45.99 U$1.P$1 | SBMP180-GND.1 75.6,44.56 75.6,32 77.26,30.34 U$3.GND
  pour Top: 0.2,0.2 0.2,99.8 51.8,99.8 51.8,0.2
  pour Route2: 0.2,0.2 51.8,0.2 51.8,99.8 0.2,99.8
  pour Bottom: 0.2,0.2 51.8,0.2 51.8,99.8 0.2,99.8
  pour Bottom: 60.2,0.2 88.8,0.2 88.8,99.8 60.2,99.8
  pour Top: 60.2,0.2 88.8,0.2 88.8,99.8 60.2,99.8
IN  (via drill 0.6)
  Top 0.61: U$2.UART2-TX 11.8,33.96 v11.8,38.8 | v31.1,84.6 31.45,84.25 LED4.C 34.25,83 R8.1 34.35,81.3 Q1.2
  Bottom 0.61: v11.8,38.8 11.8,62.2 8.6,65.4 8.6,73.5 9.2,74.1 9.2,78.5 10.9,80.2 10.9,82.6 11.35,83 13.9,83 13.95,83 19.3,83 22,85.7 30,85.7 v31.1,84.6
N$1
  Top 0.61: LED2.C 74.88,72.11 R4.2
N$2
  Bottom 0.61: BAT.2 5.74,93.6 10.1,93.6 13.2,90.5 13.2,88.4 14.46,87.14 MAIN-POWER.P
N$3  (via drill 0.6)
  Top 0.61: U$2.TWI1-SCK 19.38,31.58 20.9,33.1 25.7,33.1 26.9,34.3 26.9,37.2 v27.3,37.6 | U$5.A5 9.79,49.5 v13.2,49.5 | v21.5,50.2 23.7,50.2 | v34.6,38.8 34.2,38.8 33.1,39.9 33.1,40.8 23.7,50.2 | 23.7,50.2 29.3,55.8 32.2,55.8 40.37,63.97 MBMP180-SCL.1
  Route2 0.61: JP8.2 10.39,72.59 8.5,70.7 8.5,64.7 10.3,62.9 10.3,49.5 8.48,47.68 U$5.A5
  Bottom 0.61: v27.3,37.6 31.28,37.6 32.44,36.44 | 32.44,36.44 U$4.SCL | v13.2,49.5 13.9,50.2 v21.5,50.2 | v34.6,38.8 32.44,36.64 32.44,36.44
N$5
  Top 0.61: FB2.1 79.3,63.3 U4.5
N$6  (via drill 0.6)
  Top 0.61: U$32.P$3 83.89,77.09 85.8,79 85.8,90.4 v85.1,91.1 | v81.5,94.8 81.5,92.43 U3.P$11
  Bottom 0.61: v85.1,91.1 85.1,91.2 v81.5,94.8
N$7  (via drill 0.6)
  Top 0.61: U$2.PWRON 34.62,32.48 v33.9,33.25
  Bottom 0.61: v33.9,33.25 2.7,33.1 1.5,34.4 1.5,78.03 CHIP-POWER.P$1
N$8  (via drill 0.6)
  Top 0.61: v12.1,63.8 12.1,54.35 U$5.A4 | v10.4,43.3 14.1,43.3 16.2,41.2 16.2,38.7 16.6,38.3 v16.8,38.3 | U$2.TWI1-SDA 18.38,33 19.3,33 20.6,34.3 v21.2,34.3
  Route2 0.406: MBMP180-SDA.1 36.91,69.1 23.5,69.1 22.7,69.9 22.7,70.8 22.2,71.3 20.5,71.3 19.7,70.5 19.7,69.3 18.9,68.5 14.89,68.5 | 19.9,33.2 21.05,34.35 21.15,34.35
  Route2 0.61: 14.89,68.5 JP8.3 | v16.8,38.3 16.8,34 17.6,33.2 19.9,33.2 | U$4.SDA 34.5,34.35 21.25,34.35 v21.2,34.3 21.15,34.35 21.1,34.4
  Bottom 0.61: JP8.3 13.29,70 12.7,70 12.1,69.4 v12.1,63.8 | U$5.A4 10.4,47.79 v10.4,43.3
N$9
  Top 0.61: R2.2 LED3.A
N$10  (via drill 0.6)
  Top 0.61: v79.4,74.2 80.02,74.82 U3.P$9
  Bottom 0.61: SGPS-TX.1 80.66,97.84 86.5,92 86.5,80.2 80.4,74.1 79.5,74.1 v79.4,74.2
N$11
  Top 0.61: LED4.A R3.2
N$12
  Top 0.406: 20.96,72.56 19.7,71.3 17.7,71.3 17.4,71 17.2,70.8 17.2,39.8
  Top 0.61: JP8.10 20.96,72.56 | U$5.TX0 18.21,38.79 17.2,39.8
N$13
  Top 0.61: R7.1 LED5.A
N$14
  Top 0.61: D1.A 26.07,89.08 L1.P$2 23.05,87.13 U6.5
N$15  (via drill 0.6)
  Route2 0.61: v13.4,38.8 13.4,44.9 16.2,47.7 16.2,52.3 14.5,54 14.5,62.1 17.9,65.5 21.5,65.5 22.9,66.9 22.9,68.4 21.9,69.4 21.61,69.4 JP8.9
  Bottom 0.61: U$5.RX1 17.83,41.33 15.5,39 13.6,39 v13.4,38.8
N$16
  Top 0.61: SGPS-RX.1 83.89,97.74 D2.C
N$17  (via drill 0.6)
  Top 0.61: U$5.GND 5.33,41.33 9,45 11.1,45 14.7,48.6 14.7,53.7 v15.9,54.9 | v21.7,56.6 22.86,57.76 MGPS-GND.1
  Bottom 0.61: v15.9,54.9 16.3,55.3 21.3,55.3 21.7,55.7 v21.7,56.6
N$19
  Top 0.61: U$1.P$4 84.47,37.61 SBMP180-VIN.1 82.34,29.33 U$3.VIN
N$21
  Top 0.61: SBMP180-SCL.1 74.72,31.21 U$3.SCL
  Bottom 0.61: U$1.P$2 78.47,36.69 SBMP180-SCL.1
N$22
  Top 0.61: U$1.P$3 85.08,40.76 SBMP180-SDA.1 69.64,37.63 U$3.SDI-(SDA)
N$23  (via drill 0.6)
  Top 0.406: 15.3,77.37 15.3,75.1 17.2,73.2 17.2,72 15.88,70.68
  Top 0.61: C3.+ 39.6,86.6 v41.4,84.8 | v42.1,87.85 43.15,86.95 U5.1 | v41.4,84.8 41.65,85.05 U5.3 43.7,83.95 R12.2 45.05,82.6 45.9,82.6 50.5,78 50.5,64.3 46.9,60.7 | v41.4,84.8 40,83.4 40,81.6 | 40,81.6 R9.2 | 40,81.6 39.6,82 v37.5,82 | U$2.BAT 29.5,33.96 29.5,36.8 30.5,37.8 v30.5,39 | v34.5,41.3 47.4,54.2 47.4,60.2 46.9,60.7 | U$8.VCC 45.84,60.7 46.9,60.7 | v10.2,87.5 10.34,87.36 R16.2 9.74,85 Q6.1 11.63,82.55 R15.1 13.62,81.58 v15.1,80.1 15.12,80.08 Q5.1 15.3,77.37 | 15.88,70.68 JP8.5
  Bottom 0.61: v41.4,84.8 42.1,85.45 v42.1,87.85 | v37.5,82 31.3,82 29.4,80.1 v15.1,80.1 | v30.5,39 32.8,41.3 v34.5,41.3 | v10.2,87.5 7.3,87.5 2,92.8 2,95.3 3.82,97.12 BAT.1
N$24
  Top 0.61: C4.1 76.8,57.3 C5.1 75.18,58.92 FB2.2 75.18,64.34 | 75.18,64.34 R6.1 | U3.P$1 68.02,71.5 75.18,64.34
N$27  (via drill 0.6)
  Top 0.61: 40.8,89.4 C3.- | 40.8,89.4 42,89.4 C1.C | 40.6,93 C2.2 | 40.6,93 v40.5,92.9 | v40.7,90.5 40.7,89.5 40.8,89.4 | U5.2 41.6,86 40.8,86.7 40.8,89.4 | v36.9,88.6 36.9,84.8 v37,84.7 | v33,93.3 34.6,93.3 35.7,94.4 35.7,94.95 LED5.C v37,95 LED1.C 40.35,93.25 40.6,93 | JP1.2 6.33,93.23 10.8,97.7 v16.1,97.7
  Route2 0.61: v33,93.3 21.5,93.3 | 21.5,93.3 v20.3,94.5 | 21.5,93.3 21.5,88.9 20.9,88.3 19.7,88.3 18.5,87.1 18.5,82.3 17.3,81.1 v17.3,78.8
  Bottom 0.61: 37.65,95.65 38.81,96.81 U2.11 | 37.65,95.65 v37,95 | U2.13 42.7,97.53 42.7,96.3 42.05,95.65 37.65,95.65 | v40.5,92.9 40.5,90.7 v40.7,90.5 38.1,90.5 36.9,89.3 v36.9,88.6 | v37,84.7 37.6,84.7 41,81.3 41,79.25 41.9,78.35 41.9,77.7 42.79,76.81 U2.22 | v16.1,97.7 16.16,97.64 U2.1 18.81,95.99 v20.3,94.5 | v17.3,78.8 16.79,78.29 U2.35
N$29  (via drill 0.6)
  Top 0.61: R13.2 5.5,77.32 R14.1 | R14.1 1.5,70.6 1.5,47.6 2.69,46.41 U$5.VCC | R14.1 5.5,71.4 4.2,71.4 2.6,69.8 2.6,68.3 13.1,68.3 v13.3,68.1 | v21.6,67.9 23,69.3 23,73 24.2,74.2 26.4,74.2 27.2,73.4 27.2,68.82 MGPS-5V.1
  Bottom 0.61: v13.3,68.1 21.4,68.1 v21.6,67.9
N$33  (via drill 0.6)
  Top 0.61: U4.1 79.8,59.45 v79.8,58.7 | C6.1 83.03,55.73 v81.6,54.3 83.15,54.3 R5.2
  Bottom 0.61: v81.6,54.3 80.8,54.3 79.5,55.6 79.5,58.4 v79.8,58.7 79.5,59 79.5,61.5 78,63 70,63 65.5,67.5 65.5,94.3 69.04,97.84 SGPS-5V.1
N$34  (via drill 0.6)
  Top 0.61: C4.2 78.08,54.54 C5.2 | B2.- 69.21,52.2 77.5,52.2 78.7,53.4 C4.2 | C4.2 80.7,55.92 v80.7,56.3 80.7,57.5 82,58.8 U4.2 | v86,58.6 85.17,57.77 C6.2 | U$32.P$2 85.9,69.14 85.9,66.8 84.7,65.6 82.5,65.6 v81,67.1 79.7,68.4 79.7,69.8 | 79.7,69.8 79.23,70.27 78.1,70.27 | 78.1,70.27 R4.1 | 79.7,69.8 79.73,69.77 U$32.P$1 | U3.P$3 71.02,74.62 69.9,73.5 v69.4,73.5 | SGPS-GND.1 64.51,97.7 66.5,97.7 68.2,96 | 68.2,96 69.52,94.68 U3.P$19 | U3.P$12 80,92.43 80,94 78,96 68.2,96 | 68.2,96 63.7,91.5 63.7,72.4 65.6,70.5 67.5,70.5 69.9,68.1 v69.9,66.9 | U3.P$8 78.1,76.99 78.1,70.27
  Bottom 0.61: v80.7,56.3 83,58.6 | 83,58.6 v86,58.6 | v69.4,73.5 69.4,72 72.4,69 | 72.4,69 77.1,64.3 78.2,64.3 v81,67.1 85.7,62.4 85.7,61.3 83,58.6 | v69.9,66.9 72,69 72.4,69
N$35  (via drill 0.6)
  Top 0.406: JP8.4 12,71.35 8.3,71.3 6.2,69.2 5,69.2 4.7,69.5 v4.7,69.8
  Top 0.61: U$8.GND 41.25,70.35 | MBMP180-GND.1 36.13,65.23 41.25,70.35 | 41.25,70.35 37.8,73.8 32.1,73.8 30.1,75.8 30.1,79 29.1,80 28.5,80 | 28.5,80 24.95,83.55 U6.4 24.7,84.55 v24.7,86.8 | C8.C 20.95,80.1 28.5,80 | v21,87.1 20,88.1 C7.C 15.05,89.6 MAIN-POWER.S 10.39,89.68 | 10.39,89.68 JP1.1 | CHIP-POWER.P$2 8.34,87.63 10.39,89.68 | v27.9,39.7 27.9,41.8 v25.7,44
  Route2 0.61: U$4.GND 30.73,36.37 28.7,38.4 28.7,38.9 v27.9,39.7 | v24.3,47.1 21.8,47.1 21.3,47.6 17.8,47.6 16.5,46.3 16.5,40.1 15.6,39.2 U$5.GND3 | v4.7,69.8 2.4,72.1 2.4,84.5 4.6,86.7 CHIP-POWER.P$2
  Bottom 0.61: v24.7,86.8 24.4,87.1 v21,87.1 | v25.7,44 25.7,45.7 v24.3,47.1 24.7,47.1 31.2,53.6 31.2,57.75 MBMP180-GND.1
N$38
  Top 0.61: LED1.A R11.1
OUT  (via drill 0.6)
  Top 0.61: U$2.UART2-RX 11.76,31.66 v9.2,34.2 | v21.5,42.6 v24.3,42.6 | v49.1,74 LED3.C 46,76 R10.1 44.95,76.3 Q2.2
  Bottom 0.61: v9.2,34.2 18.9,34.2 21.5,36.8 v21.5,42.6 | v24.3,42.6 47.3,42.6 50.5,45.8 50.5,72.6 v49.1,74
RSSI  (via drill 0.6)
  Top 0.406: v31.25,93.15 30.35,94.05 R7.2
  Bottom 0.406: U2.7 30.35,97.64 30.35,94.05 v31.25,93.15
RTS  (via drill 0.6)
  Top 0.61: SJ1.1 v28.6,78.5
  Bottom 0.61: v28.6,78.5 28.79,78.31 U2.29
RX  (via drill 0.6)
  Top 0.61: v80.7,71.7 81.52,72.52 U3.P$10 83.89,79.78 D2.A | v77.5,67.2 77.5,64.76 R6.2
  Bottom 0.61: v80.7,71.7 80.7,70.4 v77.5,67.2
RX_5V  (via drill 0.6)
  Top 0.61: U$5.D3 24.2,56.29 v24.2,56.5
  Bottom 0.61: v24.2,56.5 29.06,61.36 MGPS-RX.1
TX  (via drill 0.6)
  Top 0.61: v31.9,67 31.9,68.53 MGPS-TX.1
  Route2 0.61: U$5.D4 18.97,54.03 16.8,56.2 16.8,56.7 18,57.9 20.7,57.9 21.5,58.7 21.5,61.5 24,64 26.6,64 27.5,64.9 29.8,64.9 v31.9,67
VBACKUP  (via drill 0.6)
  Top 0.61: U3.P$4 72.5,77.39 72.5,73.6 v71.7,72.8 | v66.8,69.1 65,67.3 v65,60.5 | v66.1,41.7 66.94,41.7 B2.+$1
  Bottom 0.61: v71.7,72.8 71.7,73.7 70.3,75.1 67.3,75.1 66.8,74.6 v66.8,69.1 | v65,60.5 65,42.8 v66.1,41.7
VINSTUP  (via drill 0.6)
  Top 0.61: U$2.VCC3V3 42.24,32.96 40.9,34.3 v39.65,34.4 | L1.P$1 24.48,92.4 C7.A 18.4,90.8 v17.1,90.8 | v16.9,84.4 16.2,83.7 16.2,77 18.42,74.78 JP8.8
  Bottom 0.406: 22.9,70.7 22.3,71.3 19.71,71.3 JP8.8
  Bottom 0.61: 22.9,70.7 22.9,35.3 23.9,34.35 v39.65,34.4 | v17.1,90.8 16.9,90.6 v16.9,84.4
VOUT  (via drill 0.6)
  Top 0.61: U$4.VIN 20.31,35.61 18.6,33.9 14.7,33.8 13.05,35.45 U$5.VCC1 | v26.5,84.4 26.5,84.35 D1.C 31.7,79.15 31.7,76.1 32.9,74.9 38.3,74.9 40.8,72.4 v42,72.4 | v21.5,81.7 | v21.5,81.7 U6.1 U6.2 | v21.5,78.75 19.85,78.35 C8.A
  Route2 0.61: v21.5,81.7 20.2,80.4 v21.5,78.75 | U$4.VIN 25.65,39.65 29.5,43.5 34.7,43.5 41.7,50.5 41.7,59.08 MBMP180-VIN1.1
  Bottom 0.406: JP8.1 12.1,71.35 16.55,71.35 17.2,72 17.2,73.1 18.3,74.2 25.7,74.2
  Bottom 0.61: v26.5,84.4 25.8,83.7 25.8,82.8 24.7,81.7 v21.5,81.7 | v42,72.4 41.3,71.7 | 41.3,71.7 33.5,71.7 30.9,69.1 27.2,69.1 26.6,69.7 26.6,73.3 25.7,74.2 | 41.3,71.7 41.3,68.3 42.1,67.5 42.1,60.68 MBMP180-VIN1.1

### Text on the board
Dimension: BOARD CUT | CHIP CUTOUT
bPlace: GWC CANSAT / UK V5 | [LOGO]
tDocu: 3V ST DOWN | 5V ST UP
tsilk_final: GWC CANSAT / UK V5 | GWC CANSAT / UK V5 | GWC CANSAT / UK V5 | [LOGO]